# EAGLE schematic BTS (EAGLE 8.7.0)
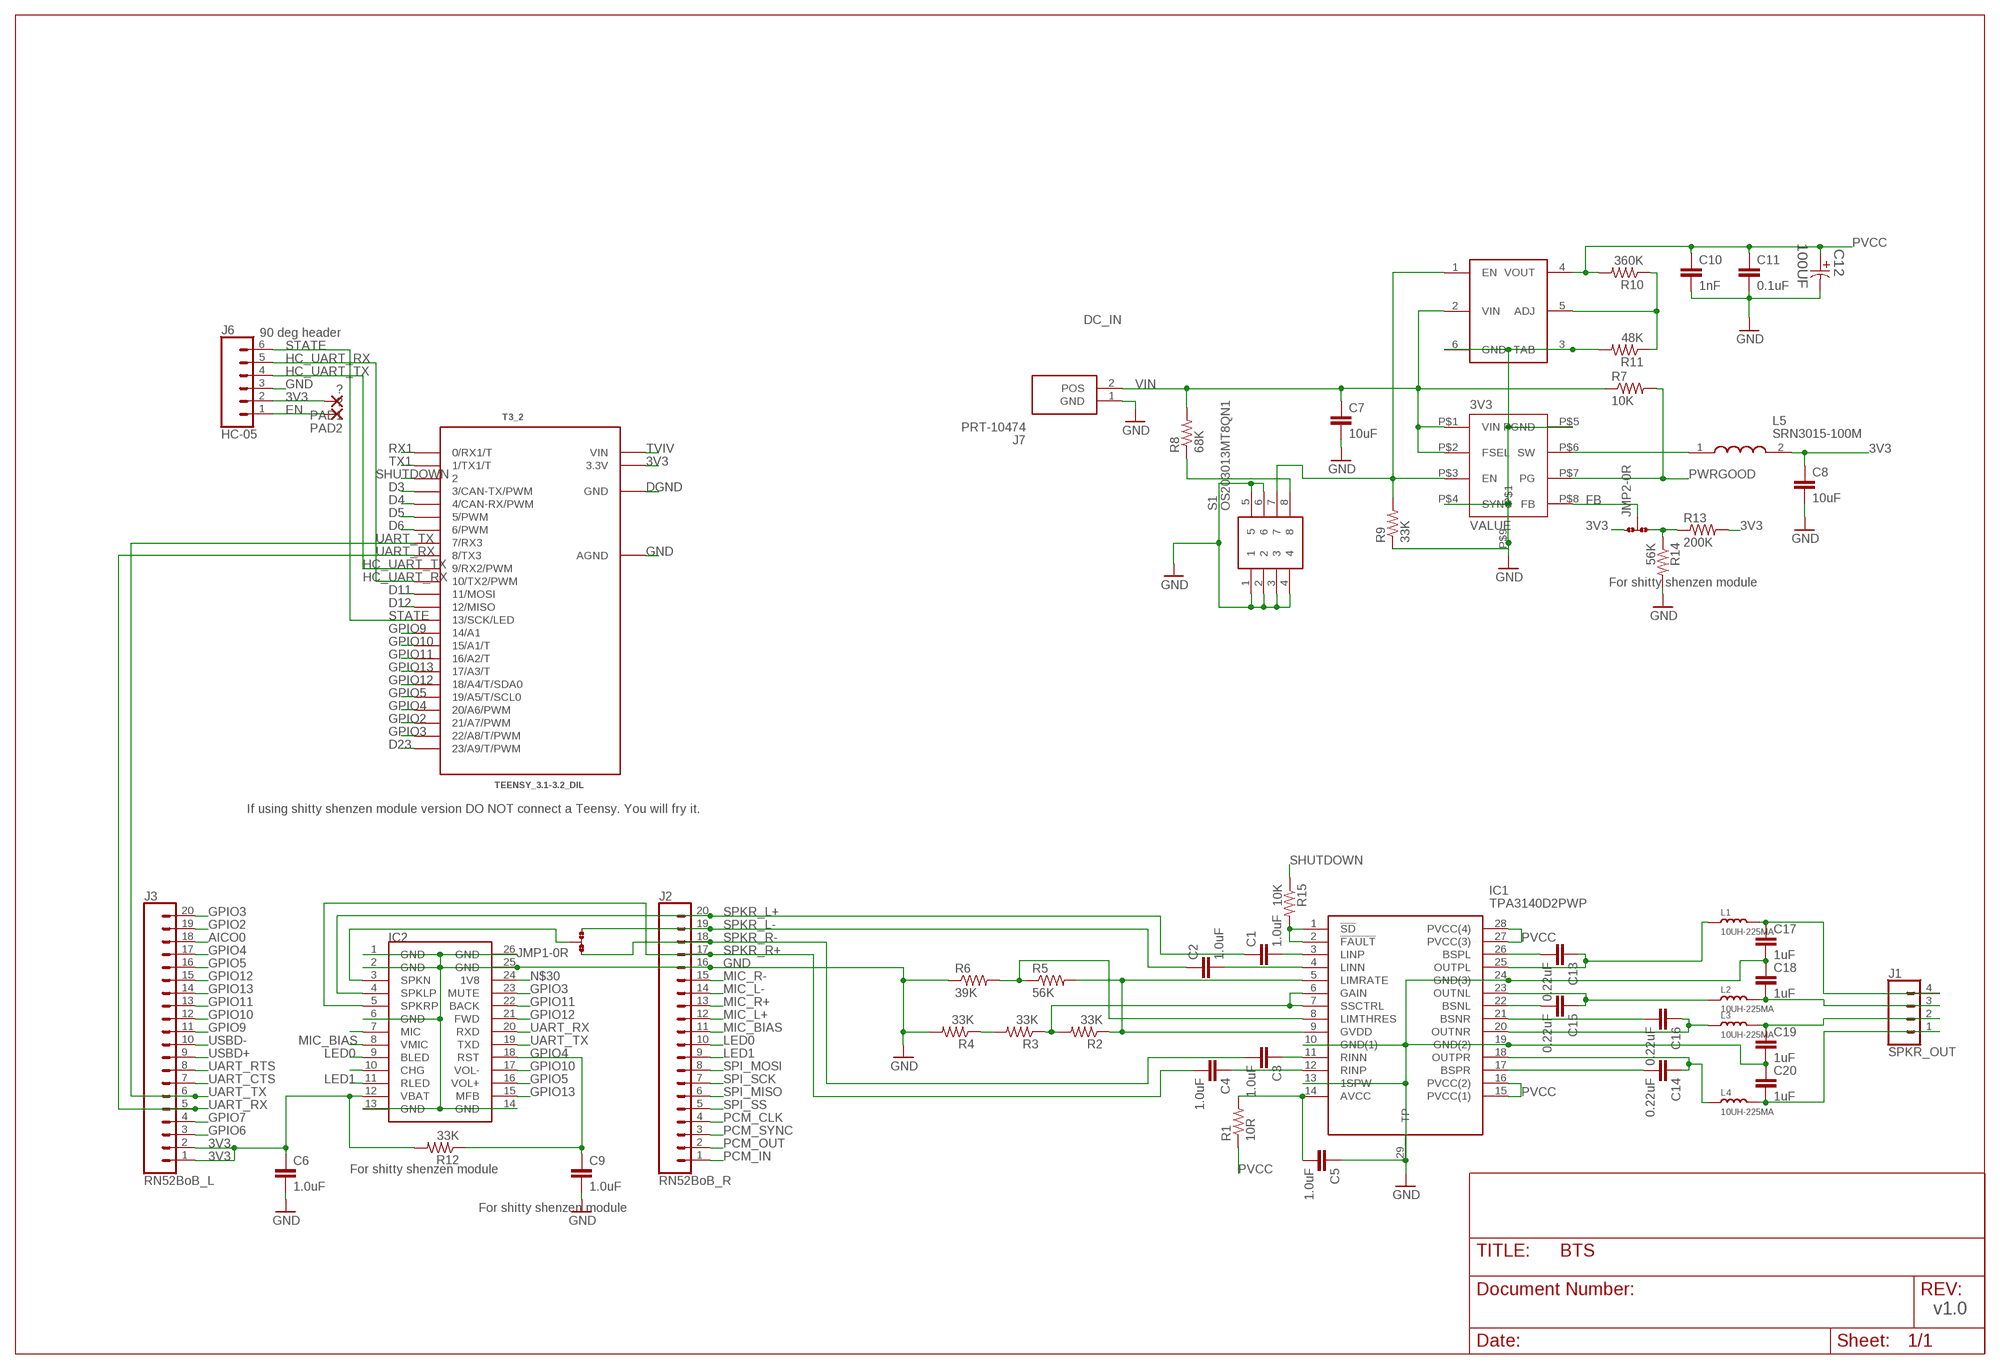
[diagram p0: schematic, sheet 1]

## Parts
3V3  ADP2370  [3MM_LFCSP_QFN]
C1  1.0uF  1.0UF-0603-16V-10%  [0603]
C2  1.0uF  1.0UF-0603-16V-10%  [0603]
C3  1.0uF  1.0UF-0603-16V-10%  [0603]
C4  1.0uF  1.0UF-0603-16V-10%  [0603]
C5  1.0uF  1.0UF-0603-16V-10%  [0603]
C6  1.0uF  1.0UF-0603-16V-10%  [0603]
C7  10uF  C-EUC3216  [C3216]
C8  10uF  C-EUC3216  [C3216]
C9  1.0uF  1.0UF-0603-16V-10%  [0603]
C10  1nF  1.0NF/1000PF-0603-50V-10%  [0603]
C11  0.1uF  0.1UF-0603-25V-(+80/-20%)  [0603]
C12  100UF  EEE-FK1C101P-CASE-D  [CAPAE660X610N]
C13  0.22uF  0.22UF-0603-50V-(-20/+80%)  [0603]
C14  0.22uF  0.22UF-0603-50V-(-20/+80%)  [0603]
C15  0.22uF  0.22UF-0603-50V-(-20/+80%)  [0603]
C16  0.22uF  0.22UF-0603-50V-(-20/+80%)  [0603]
C17  1uF  1.0NF/1000PF-0603-50V-10%  [0603]
C18  1uF  1.0NF/1000PF-0603-50V-10%  [0603]
C19  1uF  1.0NF/1000PF-0603-50V-10%  [0603]
C20  1uF  1.0NF/1000PF-0603-50V-10%  [0603]
IC1  TPA3140D2PWP  [SOP65P640X120-29N]
IC2  BLK-MD-SPK-B  [BLK-MD-SPK-B]
J1  SPKR_OUT  CONN_04SCREW  [SCREWTERMINAL-3.5MM-4]
J2  RN52BoB_R  CONN_20  [1X20]
J3  RN52BoB_L  CONN_20  [1X20]
J6  HC-05  CONN_06SILK_FEMALE_PTH  [1X06]
J7  PRT-10474  [SHDR2W320P716_1X2_1574X813X158]
JMP1  0R-JUMPA  [A0R-JMP]
JMP2  0R-JUMPA  [A0R-JMP]
L1  10UH-225MA  SMD-INDUCTOR-10UH-225MA-10%(0806)  [L0806]
L2  10UH-225MA  SMD-INDUCTOR-10UH-225MA-10%(0806)  [L0806]
L3  10UH-225MA  SMD-INDUCTOR-10UH-225MA-10%(0806)  [L0806]
L4  10UH-225MA  SMD-INDUCTOR-10UH-225MA-10%(0806)  [L0806]
L5  SRN3015-100M  [SRN3015]
PAD1  ?  SMD2  [SMD1,27-2,54]
PAD2  ?  SMD2  [SMD1,27-2,54]
R1  10R  R-US_R0603  [R0603]
R2  33K  R-US_R0603  [R0603]
R3  33K  R-US_R0603  [R0603]
R4  33K  R-US_R0603  [R0603]
R5  56K  R-US_R0603  [R0603]
R6  39K  R-US_R0603  [R0603]
R7  10K  R-US_R0603  [R0603]
R8  68K  R-US_R0603  [R0603]
R9  33K  R-US_R0603  [R0603]
R10  360K  R-US_R0603  [R0603]
R11  48K  R-US_R0603  [R0603]
R12  33K  R-US_R0603  [R0603]
R13  200K  R-US_R0603  [R0603]
R14  56K  R-US_R0603  [R0603]
R15  10K  R-US_R0603  [R0603]
S1  OS203013MT8QN1  [OS203013MT8QN1]
T3_2  TEENSY_3.1-3.2_DIL  [TEENSY_3.0-3.2&LC_DIL]
U$2  NCP59302  [D2PAK-5]

## Nets
3V3: C6.1 C8.1 IC2.12(VBAT) J3.1 J3.2 J6.2 JMP2.1 L5.2 PAD1.1(P) R12.2 R13.2 T3_2.3.3V
AICO0: J3.18
BSNL: C15.2 IC1.22(BSNL)
BSNR: C16.2 IC1.21(BSNR)
BSPL: C13.2 IC1.26(BSPL)
BSPR: C14.2 IC1.17(BSPR)
D3: T3_2.3(3/CAN-TX/PWM)
D4: T3_2.4(4/CAN-RX/PWM)
D5: T3_2.5(5/PWM)
D6: T3_2.6(6/PWM)
D11: T3_2.11(11/MOSI)
D12: T3_2.12(12/MISO)
D23: T3_2.23/A9(23/A9/T/PWM)
DGND: T3_2.GND
EN: J6.1 PAD2.1(P)
FB: 3V3.P$8(FB) JMP2.2
GAIN: IC1.6(GAIN) IC1.7(SSCTRL) R2.2 R3.1
GND: 3V3.P$4(SYNC) 3V3.P$5(PGND) 3V3.P$9 C5.1 C6.2 C7.2 C8.2 C9.2 C10.2 C11.2 C12.2 C17.2 C18.1 C19.2 C20.1 IC1.10(GND(1)) IC1.13(1SPW) IC1.19(GND(2)) IC1.24(GND(3)) IC1.29(TP) IC2.1(GND) IC2.2(GND) IC2.6(GND) IC2.13(GND) IC2.14(GND) IC2.25(GND) IC2.26(GND) J2.16 J6.3 J7.1(GND) R4.2 R6.1 R9.1 R11.2 R14.2 S1.1 S1.2 S1.3 S1.4 S1.5 S1.6 T3_2.AGND U$2.3(TAB) U$2.6(GND)
GPIO2: J3.19 T3_2.21/A7(21/A7/PWM)
GPIO3: IC2.23(MUTE) J3.20 T3_2.22/A8(22/A8/T/PWM)
GPIO4: C9.1 IC2.18(RST) J3.17 R12.1 T3_2.20/A6(20/A6/PWM)
GPIO5: IC2.16(VOL+) J3.16 T3_2.19/A5(19/A5/T/SCL0)
GPIO6: J3.3
GPIO7: J3.4
GPIO9: J3.11 T3_2.14/A0(14/A1)
GPIO10: IC2.17(VOL-) J3.12 T3_2.15/A1(15/A1/T)
GPIO11: IC2.22(BACK) J3.13 T3_2.16/A2(16/A2/T)
GPIO12: IC2.21(FWD) J3.15 T3_2.18/A4(18/A4/T/SDA0)
GPIO13: IC2.15(MFB) J3.14 T3_2.17/A3(17/A3/T)
GVDD: IC1.5(LIMRATE) IC1.9(GVDD) R2.1 R5.2
HC_UART_RX: J6.5 T3_2.10(10/TX2/PWM)
HC_UART_TX: J6.4 T3_2.9(9/RX2/PWM)
LED0: IC2.9(BLED) J2.10
LED1: IC2.11(RLED) J2.9
LIMTHRES: IC1.8(LIMTHRES) R5.1 R6.2
LINN: C2.2 IC1.4(LINN)
LINP: C1.2 IC1.3(LINP)
MIC_BIAS: IC2.8(VMIC) J2.11
MIC_L+: J2.12
MIC_L-: J2.14
MIC_R+: J2.13
MIC_R-: J2.15
N$1: C5.2 IC1.14(AVCC) R1.2
N$2: IC1.1(!SD) IC1.2(!FAULT) R15.2
N$3: R3.2 R4.1
N$16: IC2.7(MIC)
N$19: C17.1 J1.4 L1.2
N$20: C18.2 J1.3 L2.2
N$21: C19.1 J1.2 L3.2
N$22: C20.2 J1.1 L4.2
N$23: JMP2.3 R13.1 R14.1
N$26: IC2.10(CHG)
N$28: IC2.3(SPKN) JMP1.2
N$30: IC2.24(1V8)
N$63: 3V3.P$3(EN) R9.2 S1.7 U$2.1(EN)
N$64: 3V3.P$6(SW) L5.1
N$65: R8.1 S1.8
N$66: R10.1 R11.1 U$2.5(ADJ)
OUTNL: C15.1 IC1.23(OUTNL) L2.1
OUTNR: C16.1 IC1.20(OUTNR) L3.1
OUTPL: C13.1 IC1.25(OUTPL) L1.1
OUTPR: C14.1 IC1.18(OUTPR) L4.1
PCM_CLK: J2.4
PCM_IN: J2.1
PCM_OUT: J2.2
PCM_SYNC: J2.3
PVCC: C10.1 C11.1 C12.1 IC1.15(PVCC(1)) IC1.16(PVCC(2)) IC1.27(PVCC(3)) IC1.28(PVCC(4)) R1.1 R10.2 U$2.4(VOUT)
PWRGOOD: 3V3.P$7(PG) R7.2
RINN: C3.1 IC1.11(RINN)
RINP: C4.1 IC1.12(RINP)
RX1: T3_2.0(0/RX1/T)
SHUTDOWN: R15.1 T3_2.2
SPI_MISO: J2.6
SPI_MOSI: J2.8
SPI_SCK: J2.7
SPI_SS: J2.5
SPKR_L+: C1.1 IC2.4(SPKLP) J2.20
SPKR_L-: C2.1 J2.19 JMP1.3
SPKR_R+: C4.2 IC2.5(SPKRP) J2.17
SPKR_R-: C3.2 J2.18 JMP1.1
STATE: J6.6 T3_2.13(13/SCK/LED)
TVIV: T3_2.VIN
TX1: T3_2.1(1/TX1/T)
UART_CTS: J3.7
UART_RTS: J3.8
UART_RX: IC2.20(RXD) J3.5 T3_2.8(8/TX3)
UART_TX: IC2.19(TXD) J3.6 T3_2.7(7/RX3)
USBD+: J3.9
USBD-: J3.10
VIN: 3V3.P$1(VIN) 3V3.P$2(FSEL) C7.1 J7.2(POS) R7.1 R8.2 U$2.2(VIN)

## Notes on the sheet
- DC_IN
- 90 deg header
- For shitty shenzen module
- If using shitty shenzen module version DO NOT connect a Teensy. You will fry it.
- For shitty shenzen module
- For shitty shenzen module
- v1.0

## Library data of the parts
3V3 = myLib:ADP2370
C1-C6 C9 = SparkFun-Capacitors:1.0UF: 1µF ceramic capacitors A capacitor is a passive two-terminal electrical component used to store electrical energy temporarily in an electric field.; PROD_ID: CAP-00868
C7 = rcl:C-EU: CAPACITOR, European symbol; SPICEPREFIX: 10uF
C8 = rcl:C-EU: CAPACITOR, European symbol; SPICEPREFIX: C
C10 = SparkFun-Capacitors:1.0NF/1000PF: 1nF/1,000pF ceramic capacitors A capacitor is a passive two-terminal electrical component used to store electrical energy temporarily in an electric field.; PROD_ID: CAP-07886
C11 = SparkFun-Capacitors:0.1UF: 0.1µF ceramic capacitors A capacitor is a passive two-terminal electrical component used to store electrical energy temporarily in an electric field.; PROD_ID: CAP-00810
C12 = Panasonic-EEEFK_EEEFP:EEE-: Aluminum Electrolytic Capacitors,Surface Mount Type; MPN: EEE-FK1C101P; OC_FARNELL: 9695672; OC_NEWARK: 80K9525; PACKAGE: CASE-D; SUPPLIER: PANASONIC; TOLERANCE: ±20 %; VOLTAGERATING: 16V
C13-C16 = SparkFun-Capacitors:0.22UF: 0.22µF ceramic capacitors A capacitor is a passive two-terminal electrical component used to store electrical energy temporarily in an electric field.; PROD_ID: CAP-09885
C17-C20 = SparkFun-Capacitors:1.0NF/1000PF: 1nF/1,000pF ceramic capacitors A capacitor is a passive two-terminal electrical component used to store electrical energy temporarily in an electric field.; PROD_ID: CAP-07886; VALUE: 1nF
IC1 = TPA3140D2PWP:TPA3140D2PWP: Audio Amplifiers 10W Class-D Audio Amp Source: Datasheet <http://www.mouser.com/ds/2/405/tpa3140d2-558212.pdf>; DESCRIPTION: Audio Amplifiers 10W Class-D Audio Amp; HEIGHT: 1.2mm; MANUFACTURER_NAME: Texas Instruments; MANUFACTURER_PART_NUMBER: TPA3140D2PWP; SUPPLIER_NAME: RS
IC2 = BLK-MD-SPK-B:BLK-MD-SPK-B
J1 = SparkFun-Connectors:CONN_04: Multi connection point. Often used as Generic Header-pin footprint for 0.1 inch spaced/style header connections On any of the 0.1 inch spaced packages, you can populate with these: Break Away Headers - Straight <https://www.sparkfun.com/products/116> (PRT-00116) Break Away Male Headers - Right Angle <https://www.sparkfun.com/products/553> (PRT-00553) Female Headers <https://www.sparkfun.com/products/115> (PRT-00115) Break Away Headers - Machine Pin <https://www.sparkfun.com/products/117> (PRT-00117) Break Away Female Headers - Swiss Machine Pin <https://www.sparkfun.com/products/743> (PRT-00743) For SCREWTERMINALS and SPRING TERMINALS visit here: Screw Terimnals on SparkFun.com <https://www.sparkfun.com/search/results?term=Screw+Terminals> (5mm/3.5mm/2.54mm spacing) This device is also useful as a general connection point to wire up your design to another part of your project. Our various solder wires solder well into these plated through hole pads. Hook-Up Wire - Assortment (Stranded, 22 AWG) <https://www.sparkfun.com/products/11375> (PRT-11375) Hook-Up Wire - Assortment (Solid Core, 22 AWG) <https://www.sparkfun.com/products/11367> (PRT-11367) View the entire wire category on our website here <https://www.sparkfun.com/categories/141> Special notes: Molex polarized connector foot print use with SKU : PRT-08231 with associated crimp pins and housings. 1MM SMD Version SKU: PRT-10208; PROD_ID: 2xCONN-08399; SF_ID: 2xPRT-08084
J2 J3 = SparkFun-Connectors:CONN_20: Multi connection point. Often used as Generic Header-pin footprint for 0.1 inch spaced/style header connections On any of the 0.1 inch spaced packages, you can populate with these: Break Away Headers - Straight <https://www.sparkfun.com/products/116> (PRT-00116) Break Away Male Headers - Right Angle <https://www.sparkfun.com/products/553> (PRT-00553) Female Headers <https://www.sparkfun.com/products/115> (PRT-00115) Break Away Headers - Machine Pin <https://www.sparkfun.com/products/117> (PRT-00117) Break Away Female Headers - Swiss Machine Pin <https://www.sparkfun.com/products/743> (PRT-00743) For SCREWTERMINALS and SPRING TERMINALS visit here: Screw Terimnals on SparkFun.com <https://www.sparkfun.com/search/results?term=Screw+Terminals> (5mm/3.5mm/2.54mm spacing) This device is also useful as a general connection point to wire up your design to another part of your project. Our various solder wires solder well into these plated through hole pads. Hook-Up Wire - Assortment (Stranded, 22 AWG) <https://www.sparkfun.com/products/11375> (PRT-11375) Hook-Up Wire - Assortment (Solid Core, 22 AWG) <https://www.sparkfun.com/products/11367> (PRT-11367) View the entire wire category on our website here <https://www.sparkfun.com/categories/141> Special notes: Molex polarized connector foot print use with SKU : PRT-08231 with associated crimp pins and housings. 1MM SMD Version SKU: PRT-10208 NOTES ON THE VARIANTS LOCK and LOCK_LONGPADS... This footprint was designed to help hold the alignment of a through-hole component (i.e. 6-pin header) while soldering it into place. You may notice that each hole has been shifted either up or down by 0.005 of an inch from it's more standard position (which is a perfectly straight line). This slight alteration caused the pins (the squares in the middle) to touch the edges of the holes. Because they are alternating, it causes a "brace" to hold the component in place. 0.005 has proven to be the perfect amount of "off-center" position when using our standard breakaway headers. Although looks a little odd when you look at the bare footprint, once you have a header in there, the alteration is very hard to notice. Also,if you push a header all the way into place, it is covered up entirely on the bottom side. Note about LOCK SPECIAL package: This is just like the LOCK variant in that the holes are staggared by 5 mil, but except for the last two holes. They are not altered from the "standard" footprint layout. This is used for a special purpose on the layout of our Graphic LCD Backpack. Make sure you want to use this device before selecting it for you project!
J6 = SparkFun-Connectors:CONN_06: Multi connection point. Often used as Generic Header-pin footprint for 0.1 inch spaced/style header connections On any of the 0.1 inch spaced packages, you can populate with these: Break Away Headers - Straight <https://www.sparkfun.com/products/116> (PRT-00116) Break Away Male Headers - Right Angle <https://www.sparkfun.com/products/553> (PRT-00553) Female Headers <https://www.sparkfun.com/products/115> (PRT-00115) Break Away Headers - Machine Pin <https://www.sparkfun.com/products/117> (PRT-00117) Break Away Female Headers - Swiss Machine Pin <https://www.sparkfun.com/products/743> (PRT-00743) Arduino Stackable Header - 6 Pin <https://www.sparkfun.com/products/9280> (PRT-09280) For SCREWTERMINALS and SPRING TERMINALS visit here: Screw Terimnals on SparkFun.com <https://www.sparkfun.com/search/results?term=Screw+Terminals> (5mm/3.5mm/2.54mm spacing) This device is also useful as a general connection point to wire up your design to another part of your project. Our various solder wires solder well into these plated through hole pads. Hook-Up Wire - Assortment (Stranded, 22 AWG) <https://www.sparkfun.com/products/11375> (PRT-11375) Hook-Up Wire - Assortment (Solid Core, 22 AWG) <https://www.sparkfun.com/products/11367> (PRT-11367) View the entire wire category on our website here <https://www.sparkfun.com/categories/141>; PROD_ID: CONN-08437
J7 = PRT-10474:PRT-10474: Soldering Workstation Equipment XT60 Connectors Male/Female Pair Source: Datasheet <http://cdn.sparkfun.com/datasheets/Prototyping/xt60.pdf>; DESCRIPTION: Soldering Workstation Equipment XT60 Connectors Male/Female Pair; HEIGHT: 15.875mm; MANUFACTURER_NAME: SparkFun; MANUFACTURER_PART_NUMBER: PRT-10474; SUPPLIER_NAME: RS
JMP1 JMP2 = jump-0r-smd:0R-JUMP: SMD 0R 0805 Jumper
L1-L4 = Seeed-Inductor:SMD-INDUCTOR-10UH-225MA-10%(0806): 303010042; MPN: LQH2MCN100K02L
L5 = SRN3015-100M:SRN3015-100M: Power Inductor semi-shielded SMD 10uH Bourns SRN3015 Series Shielded Wire-wound SMD Inductor with a Ferrite Core, 10 H 20% Wire-Wound 1A Idc Source: Datasheet <https://componentsearchengine.com/Datasheets/3/SRN3015-100M.pdf>; DESCRIPTION: Power Inductor semi-shielded SMD 10uH Bourns SRN3015 Series Shielded Wire-wound SMD Inductor with a Ferrite Core, 10 H 20% Wire-Wound 1A Idc; HEIGHT: mm; MANUFACTURER_NAME: Bourns; MANUFACTURER_PART_NUMBER: SRN3015-100M; RS_PART_NUMBER: 7435071; SUPPLIER_NAME: RS
PAD1 PAD2 = wirepad:SMD2: SMD PAD
R1 = resistor:R-US_: RESISTOR, American symbol; RESISTANCE: 10R
R2-R4 R9 R12 R15 = resistor:R-US_: RESISTOR, American symbol; RESISTANCE: 33K
R5 = resistor:R-US_: RESISTOR, American symbol; RESISTANCE: 56K
R6 = resistor:R-US_: RESISTOR, American symbol; RESISTANCE: 39K
R7 R10 R11 R13 R14 = resistor:R-US_: RESISTOR, American symbol; RESISTANCE: 10K
R8 = resistor:R-US_: RESISTOR, American symbol; RESISTANCE: 68K
S1 = OS203013MT8QN1:OS203013MT8QN1: OS Series Miniature Slide Switches, DP3T. Source: Datasheet <http://www.ckswitches.com/media/1428/os.pdf>; DESCRIPTION: OS Series Miniature Slide Switches, DP3T.; HEIGHT: mm; MANUFACTURER_NAME: C & K COMPONENTS; MANUFACTURER_PART_NUMBER: OS203013MT8QN1; SUPPLIER_NAME: RS
T3_2 = Teensy_3_and_LC_Series_Boards_v1.4:TEENSY_3.1-3.2_DIL: Teensy 3.1 or 3.2 in a DIL Layout.
U$2 = myLib:NCP59302